# EAGLE design Multiprotocol_STM32_MB_1.1_t (EAGLE 6.6.0)

## Sheet 1 of 4
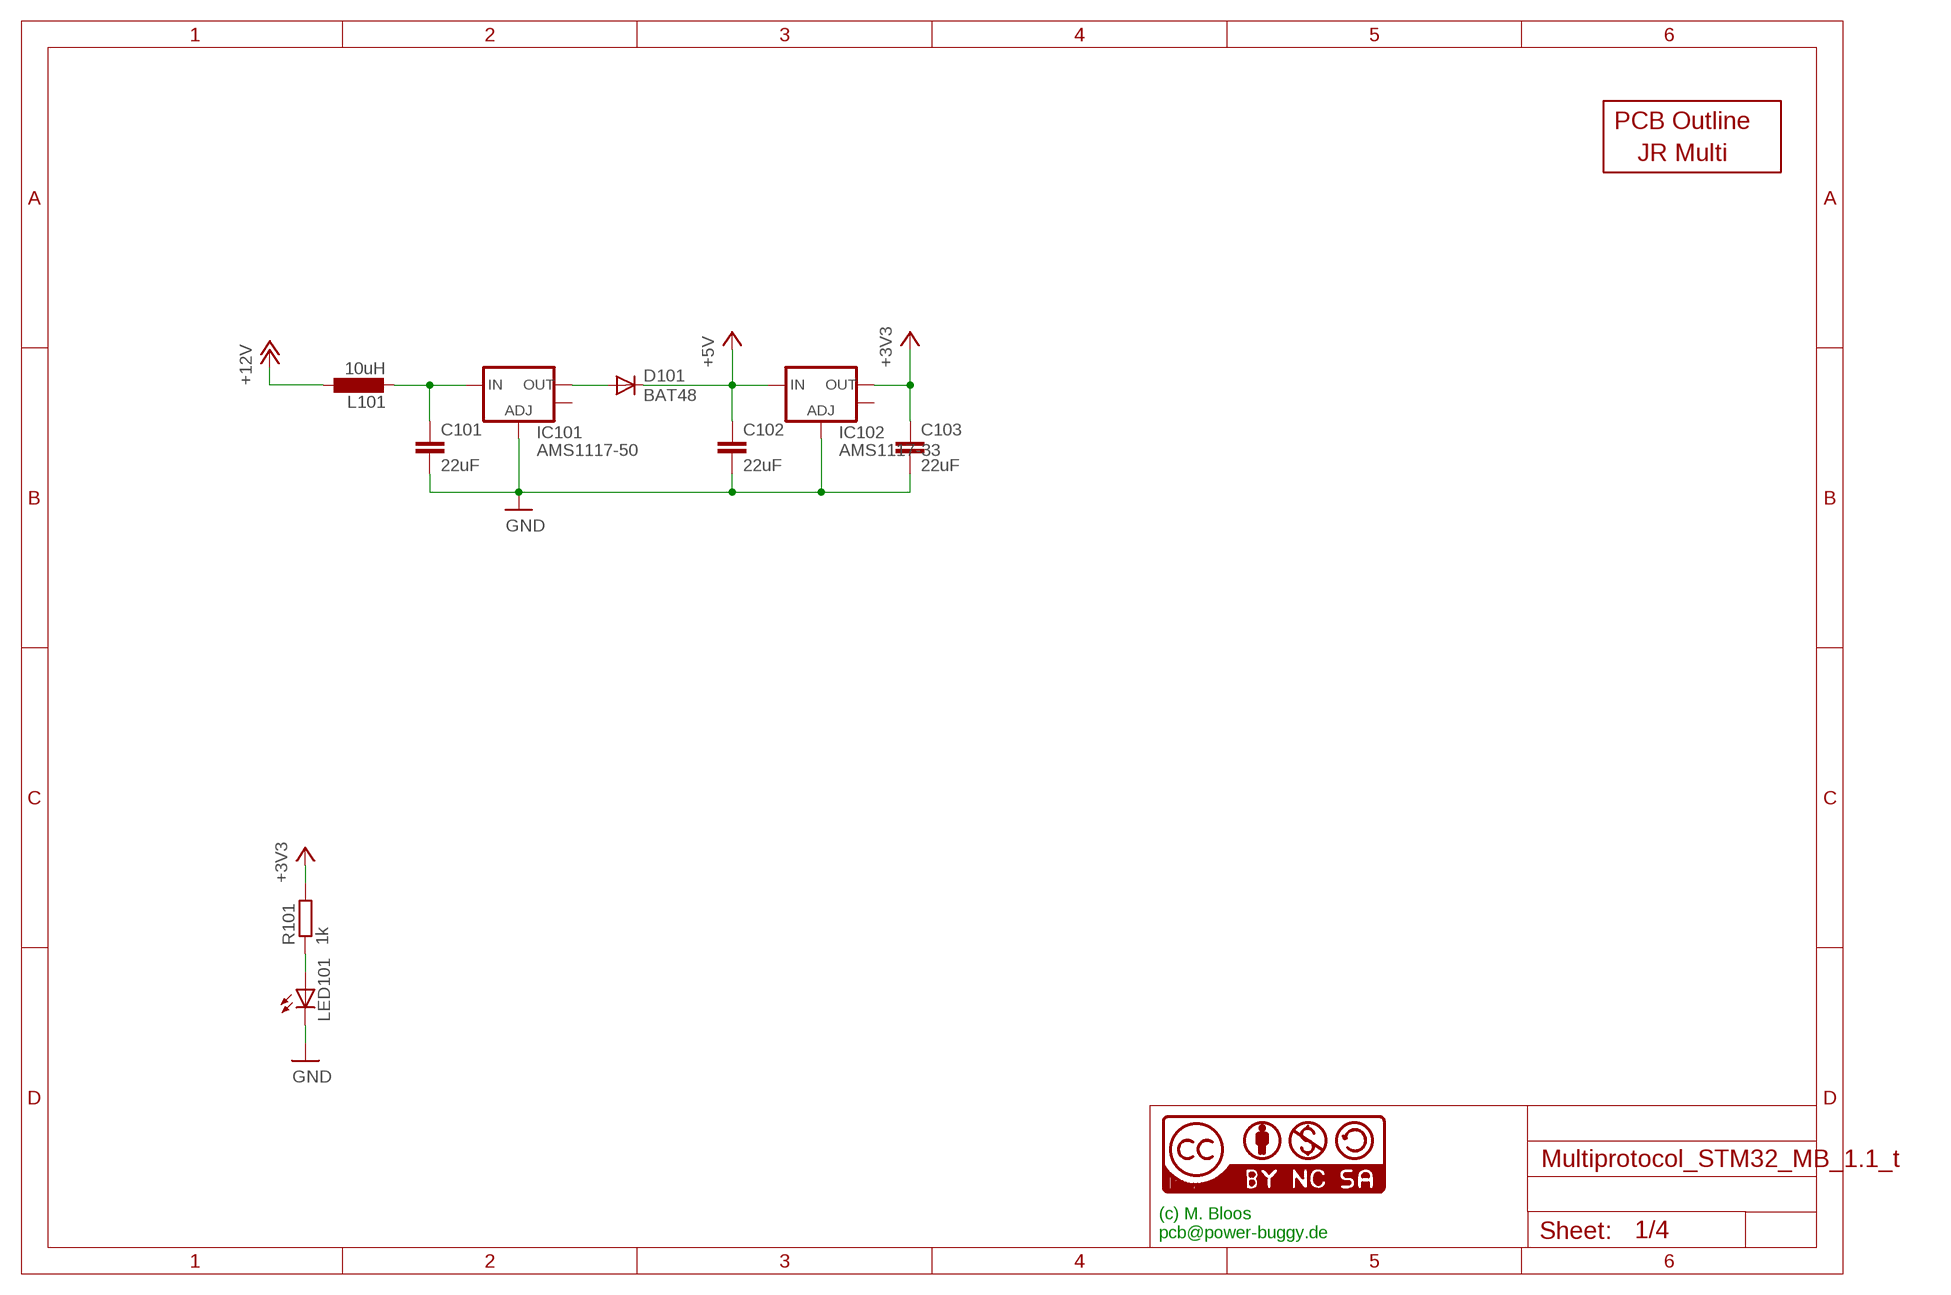
[diagram p0: schematic, sheet 1]

### Parts
C101  22uF  C-EUC1210K  [C1210K]
C102  22uF  C-EUC1210K  [C1210K]
C103  22uF  C-EUC1210K  [C1210K]
D101  BAT48  DIODE-MINIMELF  [MINIMELF]
IC101  AMS1117-50  V_REG_LM1117SOT223  [SOT223]
IC102  AMS1117-33  V_REG_LM1117SOT223  [SOT223]
L101  10uH  L-EUL1812  [L1812]
LED101  LED3MM  [LED3MM]
NIX101  CC-NC-BCNIX  [CC-NC-B_NIX]
OUTLINE101  JR_MULTI  [JR_MULTI]
R101  1k  R-EU_R0805  [R0805]

### Nets
+3V3: C103.1 IC102.2(OUT) R101.2 ; also sheet 2,3,4
+5V: C102.1 D101.C IC102.3(IN) ; also sheet 2
+12V: L101.1 ; also sheet 3
GND: C101.2 C102.2 C103.2 IC101.1(ADJ) IC102.1(ADJ) LED101.K(C) ; also sheet 2,3,4
N$4: C101.1 IC101.3(IN) L101.2
N$6: LED101.A R101.1
N$19: D101.A IC101.2(OUT)
Unconnected: IC101.4(OUT) IC102.4(OUT)

### Notes on the sheet
- (c) M. Bloos 
  pcb@power-buggy.de

## Sheet 2 of 4
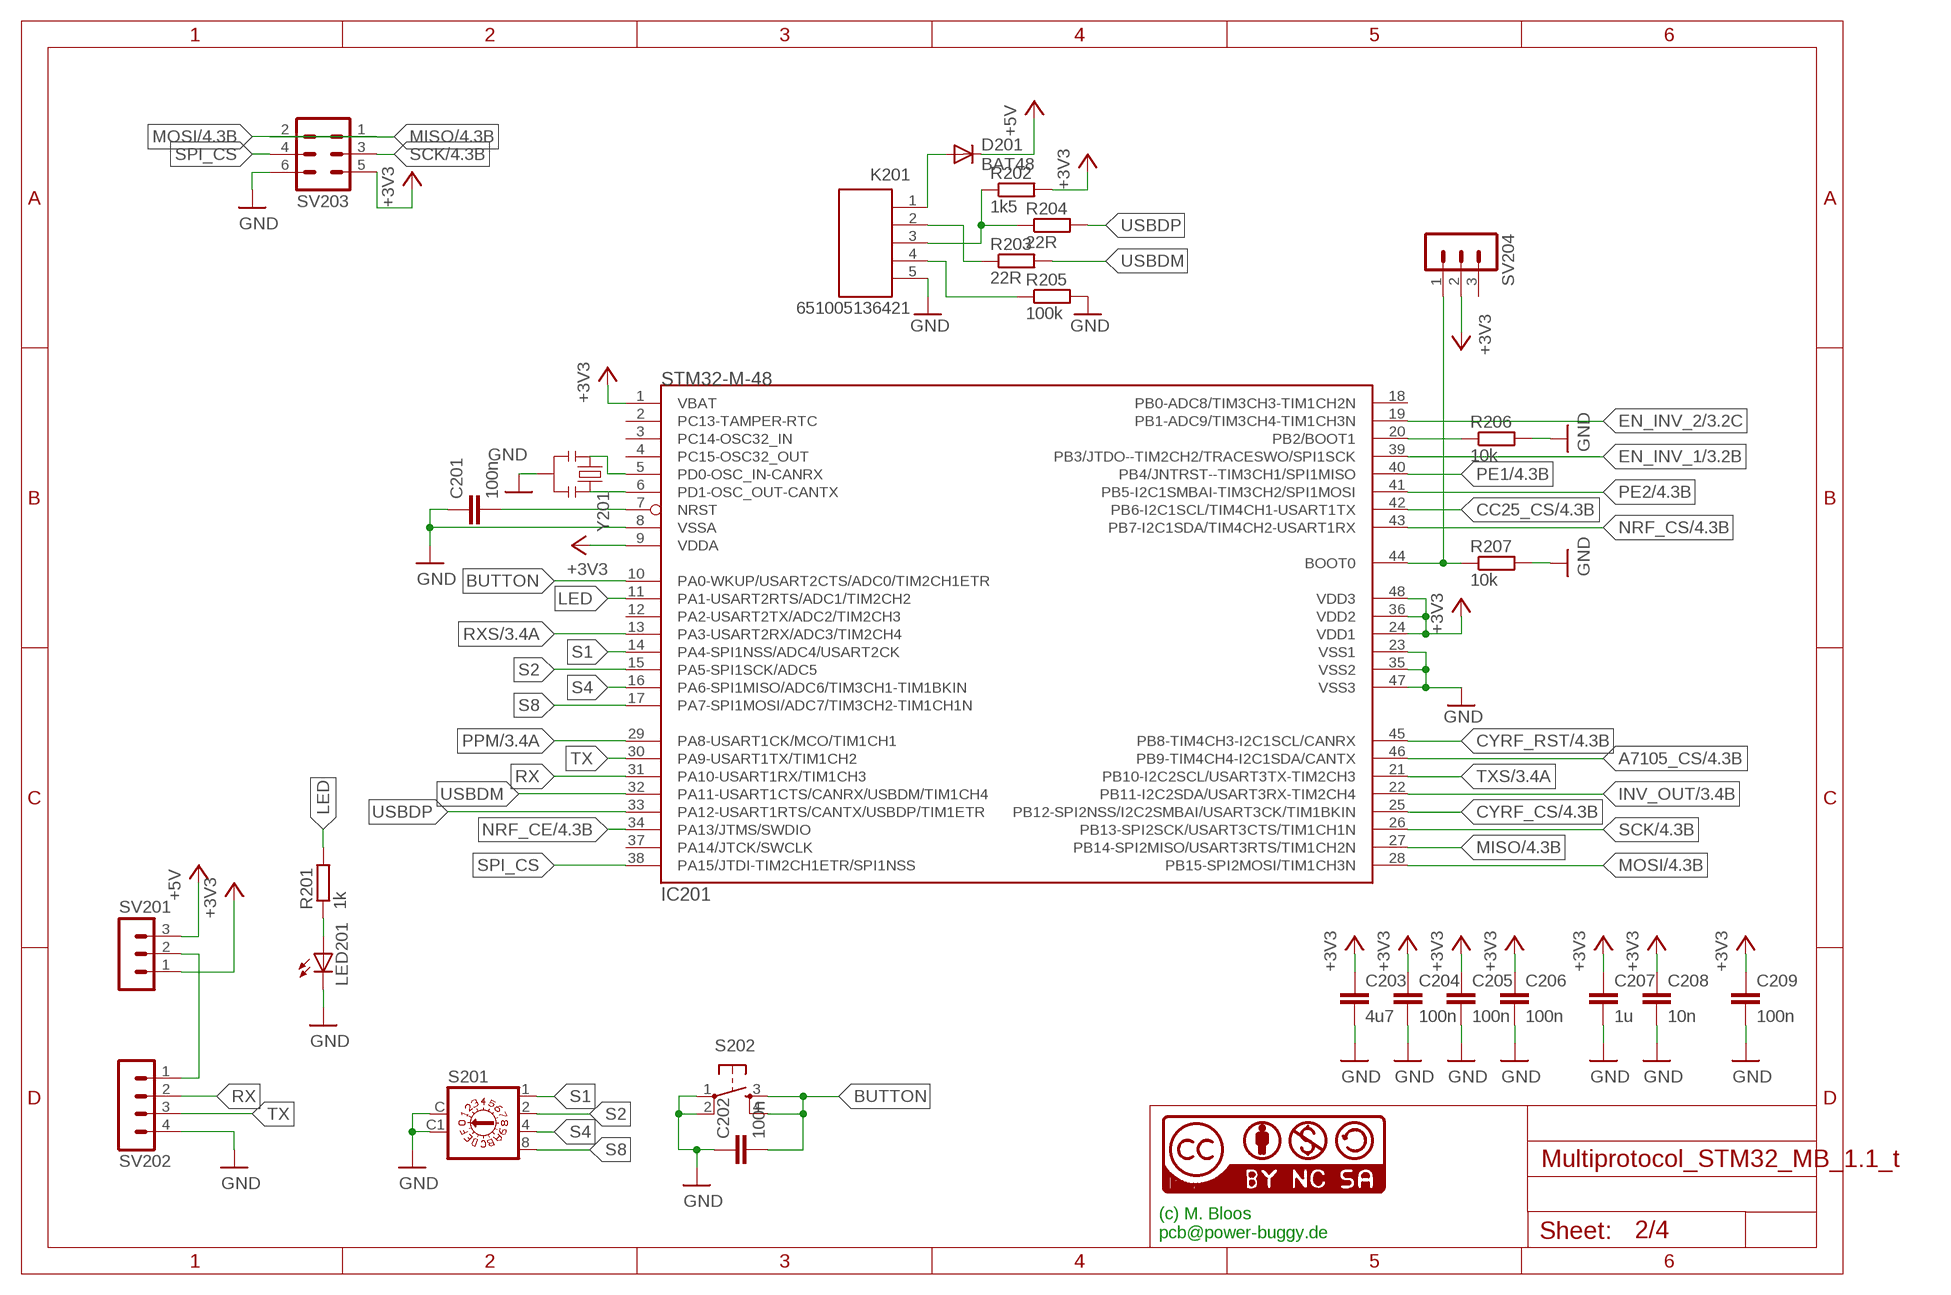
[diagram p1: schematic, sheet 2]

### Parts
C201  100n  C-EUC0805  [C0805]
C202  100n  C-EUC0805  [C0805]
C203  4u7  C-EUC0805  [C0805]
C204  100n  C-EUC0805  [C0805]
C205  100n  C-EUC0805  [C0805]
C206  100n  C-EUC0805  [C0805]
C207  1u  C-EUC0805  [C0805]
C208  10n  C-EUC0805  [C0805]
C209  100n  C-EUC0805  [C0805]
D201  BAT48  DIODE-MINIMELF  [MINIMELF]
IC201  STM32-M-48  [LQFP48]
K201  651005136421  [651005136421]
LED201  LED3MM  [LED3MM]
NIX201  CC-NC-BCNIX  [CC-NC-B_NIX]
R201  1k  R-EU_R0805  [R0805]
R202  1k5  R-EU_R0805  [R0805]
R203  22R  R-EU_R0805  [R0805]
R204  22R  R-EU_R0805  [R0805]
R205  100k  R-EU_R0805  [R0805]
R206  10k  R-EU_R0805  [R0805]
R207  10k  R-EU_R0805  [R0805]
S201  A1353HEX  [A1353HEX]
S202  TAC_SWITCHPTH  [TACTILE-PTH]
SV201  MA03-1  [MA03-1]
SV202  MA04-1  [MA04-1]
SV203  MA03-2  [MA03-2]
SV204  MA03-1  [MA03-1]
Y201  CSTCE8M00G52-R0  RESONATORSMD  [RESONATOR-SMD]

### Nets
+3V3: C203.1 C204.1 C205.1 C206.1 C207.1 C208.1 C209.1 IC201.1(VBAT) IC201.9(VDDA) IC201.24(VDD1) IC201.36(VDD2) IC201.48(VDD3) R202.2 SV201.1 SV203.5 SV204.2 ; also sheet 1,3,4
+5V: D201.C SV201.3 ; also sheet 1
A7105_CS: IC201.46(PB9-TIM4CH4-I2C1SDA/CANTX) ; also sheet 4
BUTTON: C202.2 IC201.10(PA0-WKUP/USART2CTS/ADC0/TIM2CH1ETR) S202.3 S202.4
CC25_CS: IC201.42(PB6-I2C1SCL/TIM4CH1-USART1TX) ; also sheet 4
CYRF_CS: IC201.25(PB12-SPI2NSS/I2C2SMBAI/USART3CK/TIM1BKIN) ; also sheet 4
CYRF_RST: IC201.45(PB8-TIM4CH3-I2C1SCL/CANRX) ; also sheet 4
EN_INV_1: IC201.39(PB3/JTDO--TIM2CH2/TRACESWO/SPI1SCK) ; also sheet 3
EN_INV_2: IC201.19(PB1-ADC9/TIM3CH4-TIM1CH3N) ; also sheet 3
GND: C201.1 C202.1 C203.2 C204.2 C205.2 C206.2 C207.2 C208.2 C209.2 IC201.8(VSSA) IC201.23(VSS1) IC201.35(VSS2) IC201.47(VSS3) K201.5 LED201.K(C) R205.2 R206.2 R207.2 S201.C S201.C1(NC) S202.1 S202.2 SV202.4 SV203.6 Y201.2 ; also sheet 1,3,4
INV_OUT: IC201.22(PB11-I2C2SDA/USART3RX-TIM2CH4) ; also sheet 3
LED: IC201.11(PA1-USART2RTS/ADC1/TIM2CH2) R201.2
MISO: IC201.27(PB14-SPI2MISO/USART3RTS/TIM1CH2N) SV203.2 ; also sheet 4
MOSI: IC201.28(PB15-SPI2MOSI/TIM1CH3N) SV203.1 ; also sheet 4
N$2: IC201.5(PD0-OSC_IN-CANRX) Y201.1
N$3: IC201.6(PD1-OSC_OUT-CANTX) Y201.3
N$7: SV201.2 SV202.1
N$9: K201.4 R205.1
N$11: LED201.A R201.1
N$12: C201.2 IC201.7(NRST)
N$13: K201.3 R202.1 R204.1
N$14: D201.A K201.1
N$17: K201.2 R203.1
N$23: IC201.44(BOOT0) R207.1 SV204.1
N$26: IC201.20(PB2/BOOT1) R206.1
NRF_CE: IC201.34(PA13/JTMS/SWDIO) ; also sheet 4
NRF_CS: IC201.43(PB7-I2C1SDA/TIM4CH2-USART1RX) ; also sheet 4
PE1: IC201.40(PB4/JNTRST--TIM3CH1/SPI1MISO) ; also sheet 4
PE2: IC201.41(PB5-I2C1SMBAI-TIM3CH2/SPI1MOSI) ; also sheet 4
PPM: IC201.29(PA8-USART1CK/MCO/TIM1CH1) ; also sheet 3
RX: IC201.31(PA10-USART1RX/TIM1CH3) SV202.2
RXS: IC201.13(PA3-USART2RX/ADC3/TIM2CH4) ; also sheet 3
S1: IC201.14(PA4-SPI1NSS/ADC4/USART2CK) S201.1
S2: IC201.15(PA5-SPI1SCK/ADC5) S201.2
S4: IC201.16(PA6-SPI1MISO/ADC6/TIM3CH1-TIM1BKIN) S201.4
S8: IC201.17(PA7-SPI1MOSI/ADC7/TIM3CH2-TIM1CH1N) S201.8
SCK: IC201.26(PB13-SPI2SCK/USART3CTS/TIM1CH1N) SV203.3 ; also sheet 4
SPI_CS: IC201.38(PA15/JTDI-TIM2CH1ETR/SPI1NSS) SV203.4
TX: IC201.30(PA9-USART1TX/TIM1CH2) SV202.3
TXS: IC201.21(PB10-I2C2SCL/USART3TX-TIM2CH3) ; also sheet 3
USBDM: IC201.32(PA11-USART1CTS/CANRX/USBDM/TIM1CH4) R203.2
USBDP: IC201.33(PA12-USART1RTS/CANTX/USBDP/TIM1ETR) R204.2
Unconnected: IC201.2(PC13-TAMPER-RTC) IC201.3(PC14-OSC32_IN) IC201.4(PC15-OSC32_OUT) IC201.12(PA2-USART2TX/ADC2/TIM2CH3) IC201.18(PB0-ADC8/TIM3CH3-TIM1CH2N) IC201.37(PA14/JTCK/SWCLK) SV204.3

### Notes on the sheet
- (c) M. Bloos 
  pcb@power-buggy.de

## Sheet 3 of 4
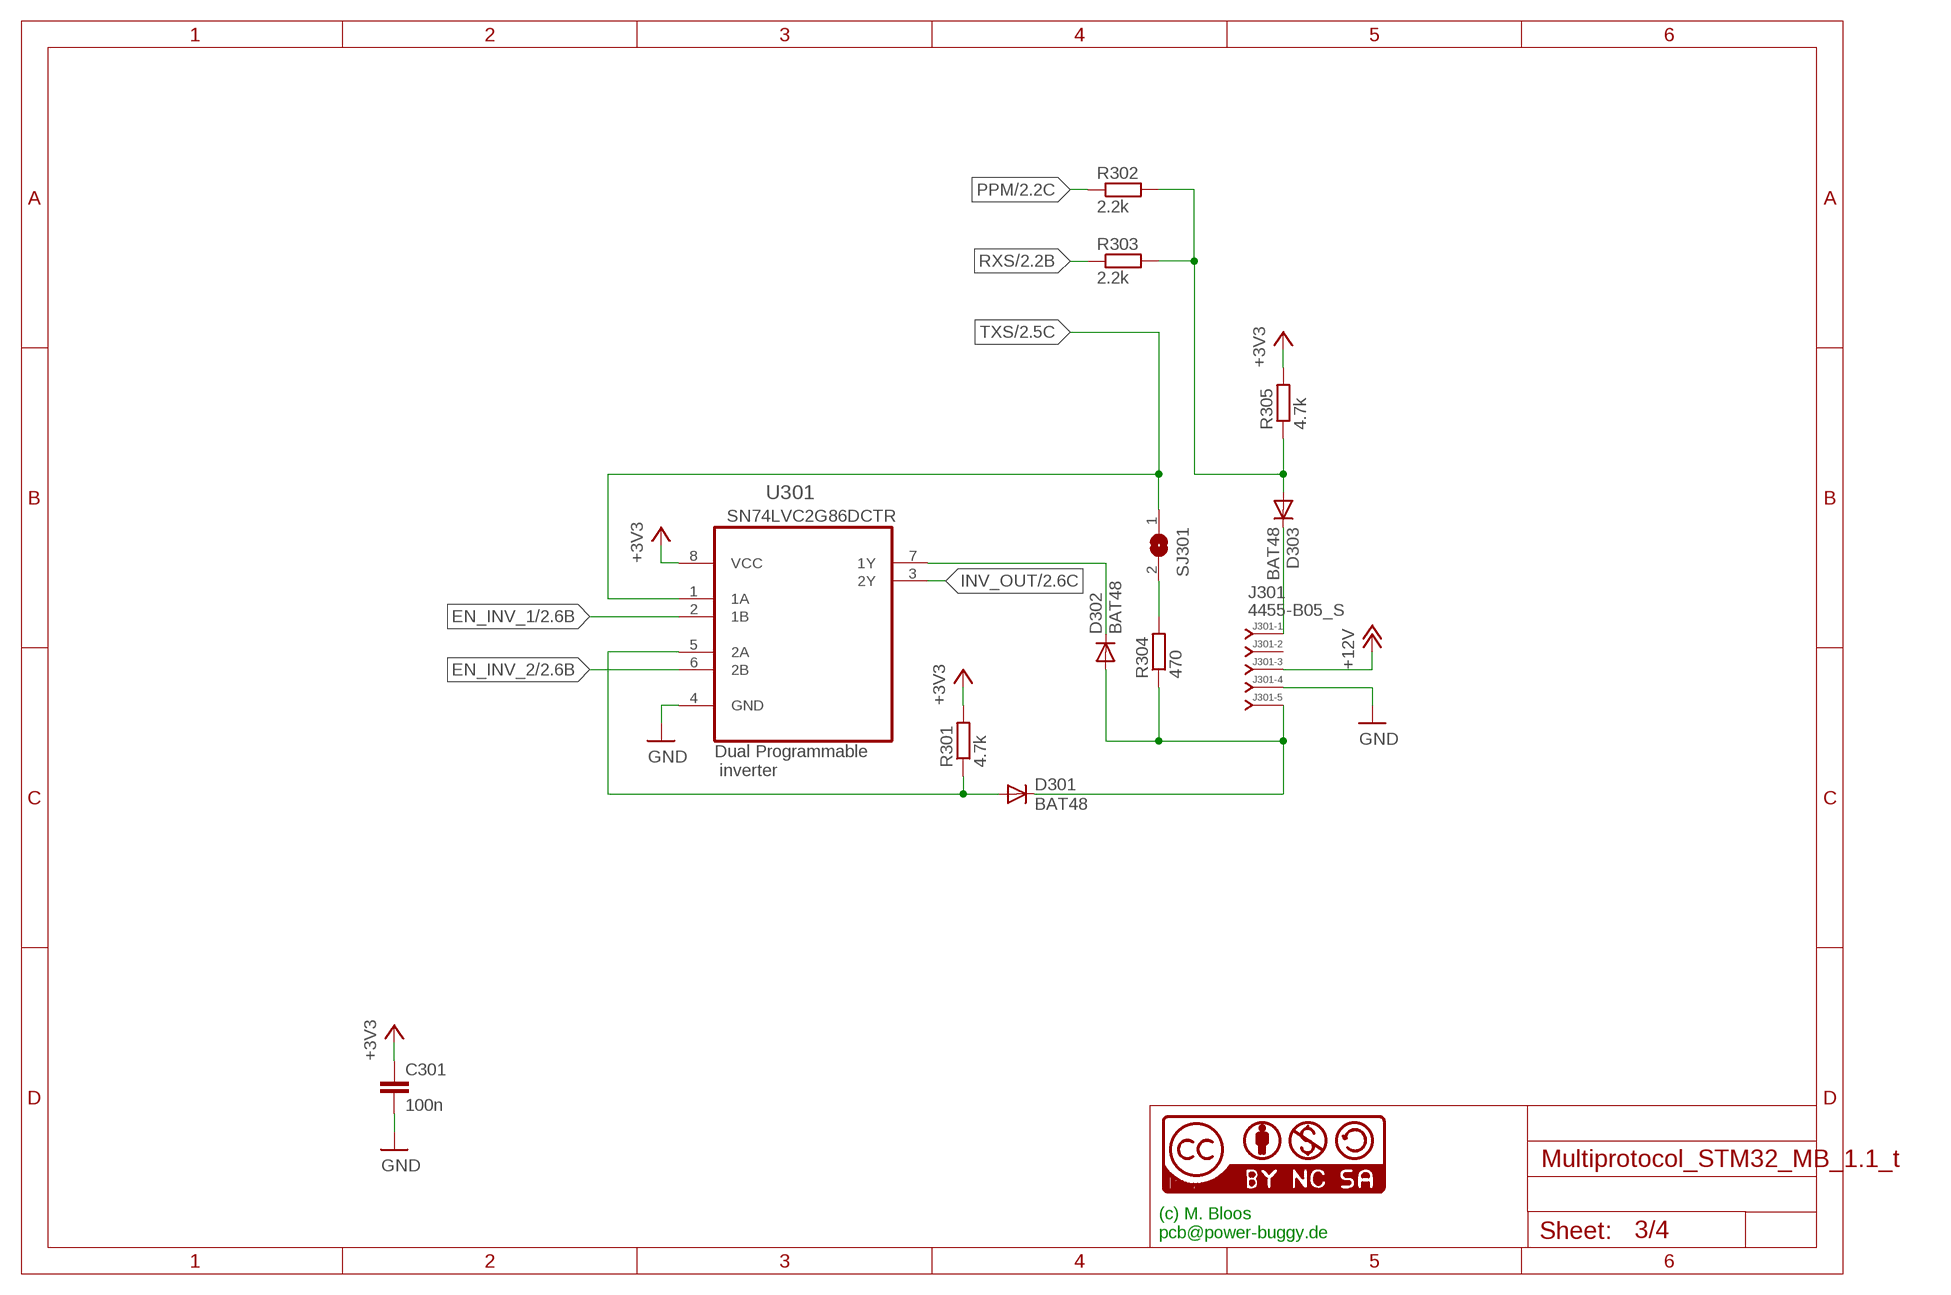
[diagram p2: schematic, sheet 3]

### Parts
C301  100n  C-EUC0805  [C0805]
D301  BAT48  DIODE-MINIMELF  [MINIMELF]
D302  BAT48  DIODE-MINIMELF  [MINIMELF]
D303  BAT48  DIODE-MINIMELF  [MINIMELF]
J301  4455-B05_S  [4455-B05]
NIX301  CC-NC-BCNIX  [CC-NC-B_NIX]
R301  4.7k  R-EU_R0805  [R0805]
R302  2.2k  R-EU_R0805  [R0805]
R303  2.2k  R-EU_R0805  [R0805]
R304  470  R-EU_R0805  [R0805]
R305  4.7k  R-EU_R0805  [R0805]
SJ301  SJ  [SJ]
U301  SN74LVC2G00DCTR  [SOP65P400X130-8N]

### Nets
+3V3: C301.1 R301.2 R305.2 U301.8(VCC) ; also sheet 1,2,4
+12V: J301.3 ; also sheet 1
EN_INV_1: U301.2(1B) ; also sheet 2
EN_INV_2: U301.6(2B) ; also sheet 2
GND: C301.2 J301.4 U301.4(GND) ; also sheet 1,2,4
INV_OUT: U301.3(2Y) ; also sheet 2
N$1: D302.C U301.7(1Y)
N$5: R304.2 SJ301.2
N$8: D301.A R301.1 U301.5(2A)
N$10: D301.C D302.A J301.5 R304.1
N$15: D303.A R302.2 R303.2 R305.1
N$18: D303.C J301.1
PPM: R302.1 ; also sheet 2
RXS: R303.1 ; also sheet 2
TXS: SJ301.1 U301.1(1A) ; also sheet 2
Unconnected: J301.2

### Notes on the sheet
- SN74LVC2G86DCTR
- Dual Programmable
   inverter
- (c) M. Bloos 
  pcb@power-buggy.de

## Sheet 4 of 4
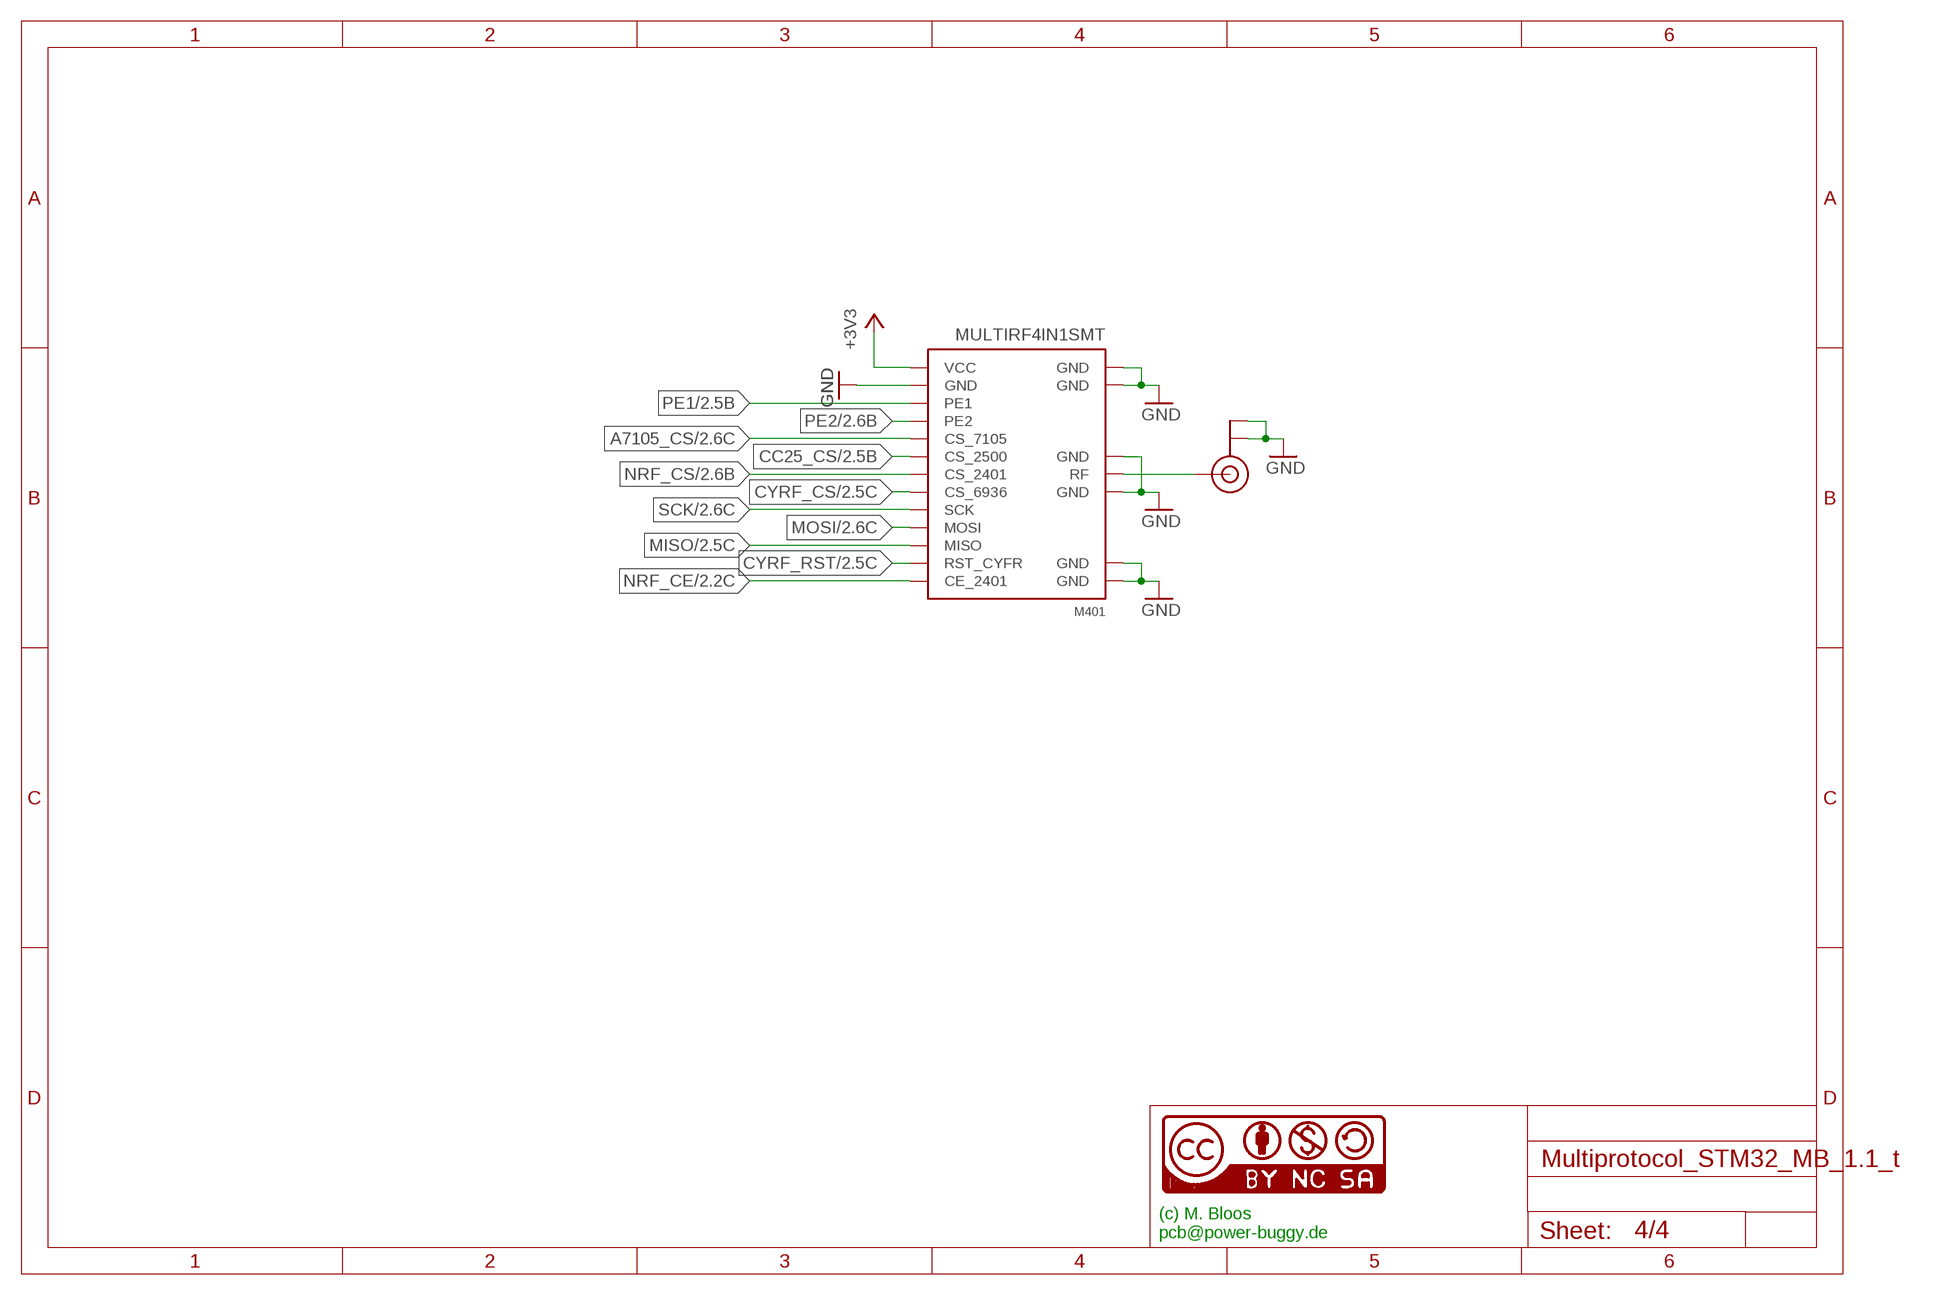
[diagram p3: schematic, sheet 4]

### Parts
CON401  U.FL  [U.FL]
M401  MULTIRF4IN1SMT  [MULTIRF4IN1-SMT]
NIX401  CC-NC-BCNIX  [CC-NC-B_NIX]

### Nets
+3V3: M401.VCC ; also sheet 1,2,3
A7105_CS: M401.CS_7105 ; also sheet 2
CC25_CS: M401.CS_2500 ; also sheet 2
CYRF_CS: M401.CS_6936 ; also sheet 2
CYRF_RST: M401.RST_CYFR ; also sheet 2
GND: CON401.P$1(GND) CON401.P$2(GND) M401.GND M401.GND@1(GND) M401.GND@2(GND) M401.GND@3(GND) M401.GND@4(GND) M401.GND@5(GND) M401.GND@6(GND) ; also sheet 1,2,3
MISO: M401.MISO ; also sheet 2
MOSI: M401.MOSI ; also sheet 2
N$16: CON401.P$3(SIGNAL) M401.RF
NRF_CE: M401.CE_2401 ; also sheet 2
NRF_CS: M401.CS_2401 ; also sheet 2
PE1: M401.PE1 ; also sheet 2
PE2: M401.PE2 ; also sheet 2
SCK: M401.SCK ; also sheet 2

### Notes on the sheet
- (c) M. Bloos 
  pcb@power-buggy.de

## Library data of the parts
C101-C103 = rcl:C-EU: CAPACITOR, European symbol
C201-C209 C301 = resistor:C-EU: CAPACITOR, European symbol
CON401 = SparkFun:U.FL
D101 D201 D301-D303 = diode:DIODE-: DIODE
IC101 IC102 = SparkFun-PowerIC:V_REG_LM1117: Voltage Regulator LM1117 Standard adjustable voltage regulator but in SMD form. Spark Fun Electronics SKU : COM-00595
IC201 = UniversalTx:STM32-M-48: STM32F103 Medium Density 48pins
J301 = con-molex-kk:4455-B05_S: RECEPTACAL
K201 = Wuerth_Elektronik_eiCan_Communication_Connectors_v2.2:651005136421: WR-COM Vertical 5 Contacts Mini USB Type B, 5 pins
L101 = resistor:L-EU: INDUCTOR, European symbol
LED101 LED201 = led:LED: LED OSRAM: - CHIPLED LG R971, LG N971, LY N971, LG Q971, LY Q971, LO R971, LY R971 LH N974, LH R974 LS Q976, LO Q976, LY Q976 LO Q996 - Hyper CHIPLED LW Q18S LB Q993, LB Q99A, LB R99A - SideLED LS A670, LO A670, LY A670, LG A670, LP A670 LB A673, LV A673, LT A673, LW A673 LH A674 LY A675 LS A676, LA A676, LO A676, LY A676, LW A676 LS A679, LY A679, LG A679 - Hyper Micro SIDELED® LS Y876, LA Y876, LO Y876, LY Y876 LT Y87S - SmartLED LW L88C, LW L88S LB L89C, LB L89S, LG L890 LS L89K, LO L89K, LY L89K LS L896, LA L896, LO L896, LY L896 - TOPLED LS T670, LO T670, LY T670, LG T670, LP T670 LSG T670, LSP T670, LSY T670, LOP T670, LYG T670 LG T671, LOG T671, LSG T671 LB T673, LV T673, LT T673, LW T673 LH T674 LS T676, LA T676, LO T676, LY T676, LB T676, LH T676, LSB T676, LW T676 LB T67C, LV T67C, LT T67C, LS T67K, LO T67K, LY T67K, LW E67C LS E67B, LA E67B, LO E67B, LY E67B, LB E67C, LV E67C, LT E67C LW T67C LS T679, LY T679, LG T679 LS T770, LO T770, LY T770, LG T770, LP T770 LB T773, LV T773, LT T773, LW T773 LH T774 LS E675, LA E675, LY E675, LS T675 LS T776, LA T776, LO T776, LY T776, LB T776 LHGB T686 LT T68C, LB T68C - Hyper Mini TOPLED® LB M676 - Mini TOPLED Santana® LG M470 LS M47K, LO M47K, LY M47K Source: http://www.osram.convergy.de LUXEON: - LUMILED® LXK2-PW12-R00, LXK2-PW12-S00, LXK2-PW14-U00, LXK2-PW14-V00 LXK2-PM12-R00, LXK2-PM12-S00, LXK2-PM14-U00 LXK2-PE12-Q00, LXK2-PE12-R00, LXK2-PE12-S00, LXK2-PE14-T00, LXK2-PE14-U00 LXK2-PB12-K00, LXK2-PB12-L00, LXK2-PB12-M00, LXK2-PB14-N00, LXK2-PB14-P00, LXK2-PB14-Q00 LXK2-PR12-L00, LXK2-PR12-M00, LXK2-PR14-Q00, LXK2-PR14-R00 LXK2-PD12-Q00, LXK2-PD12-R00, LXK2-PD12-S00 LXK2-PH12-R00, LXK2-PH12-S00 LXK2-PL12-P00, LXK2-PL12-Q00, LXK2-PL12-R00 Source: www.luxeon.com KINGBRIGHT: KA-3528ASYC Source: www.kingbright.com
M401 = 4in1_BG_V2:MULTIRF4IN1
NIX101 NIX201 NIX301 NIX401 = cc-by-nc-sa:CC-NC-BC: All hardware is licensed under the Creative Commons Attribution-Noncommercial-Share Alike 2.5 Switzerland License. To view a copy of this license, visit http://creativecommons.org/licenses/by-nc-sa/2.5/ch/ or send a letter to Creative Commons, 171 Second Street, Suite 300, San Francisco, California, 94105, USA.
OUTLINE101 = 00_meine:JR_MULTI
R101 R201-R207 R301-R305 = resistor:R-EU_: RESISTOR, European symbol
S201 = 00_meine:A1353HEX: DIL/CODE SWITCH; OC_FARNELL: unknown; OC_NEWARK: unknown
S202 = SparkFun-Electromechanical:TAC_SWITCH: Momentary Switch Button commonly used for reset or general input. Spark Fun Electronics SKU : COM-00097 SMT- SWCH-08247
SJ301 = jumper:SJ: SMD solder JUMPER
SV201 SV204 = con-lstb:MA03-1: PIN HEADER; OC_FARNELL: unknown; OC_NEWARK: unknown
SV202 = con-lstb:MA04-1: PIN HEADER; OC_FARNELL: unknown; OC_NEWARK: unknown
SV203 = con-lstb:MA03-2: PIN HEADER; OC_FARNELL: unknown; OC_NEWARK: unknown
U301 = Texas Instruments_By_element14_Batch_1:SN74LVC2G00DCTR: DUAL 2-INPUT POSITIVE-NAND GATE; MPN: SN74LVC2G00DCTR; OC_FARNELL: 1595405; OC_NEWARK: 76C4187; PACKAGE: SSOP-8; SUPPLIER: Texas Instruments
Y201 = SparkFun-FreqCtrl:RESONATOR: Resonator Small SMD resonator. This is the itty bitty 10/20MHz resonators with built in caps. CSTCE10M0G55 and CSTCE20M0V53. Footprint has been reviewed closely but hasn't been tested yet.

## Net classes
0 default: width 0.152 mm, drill 0.33 mm

## Board
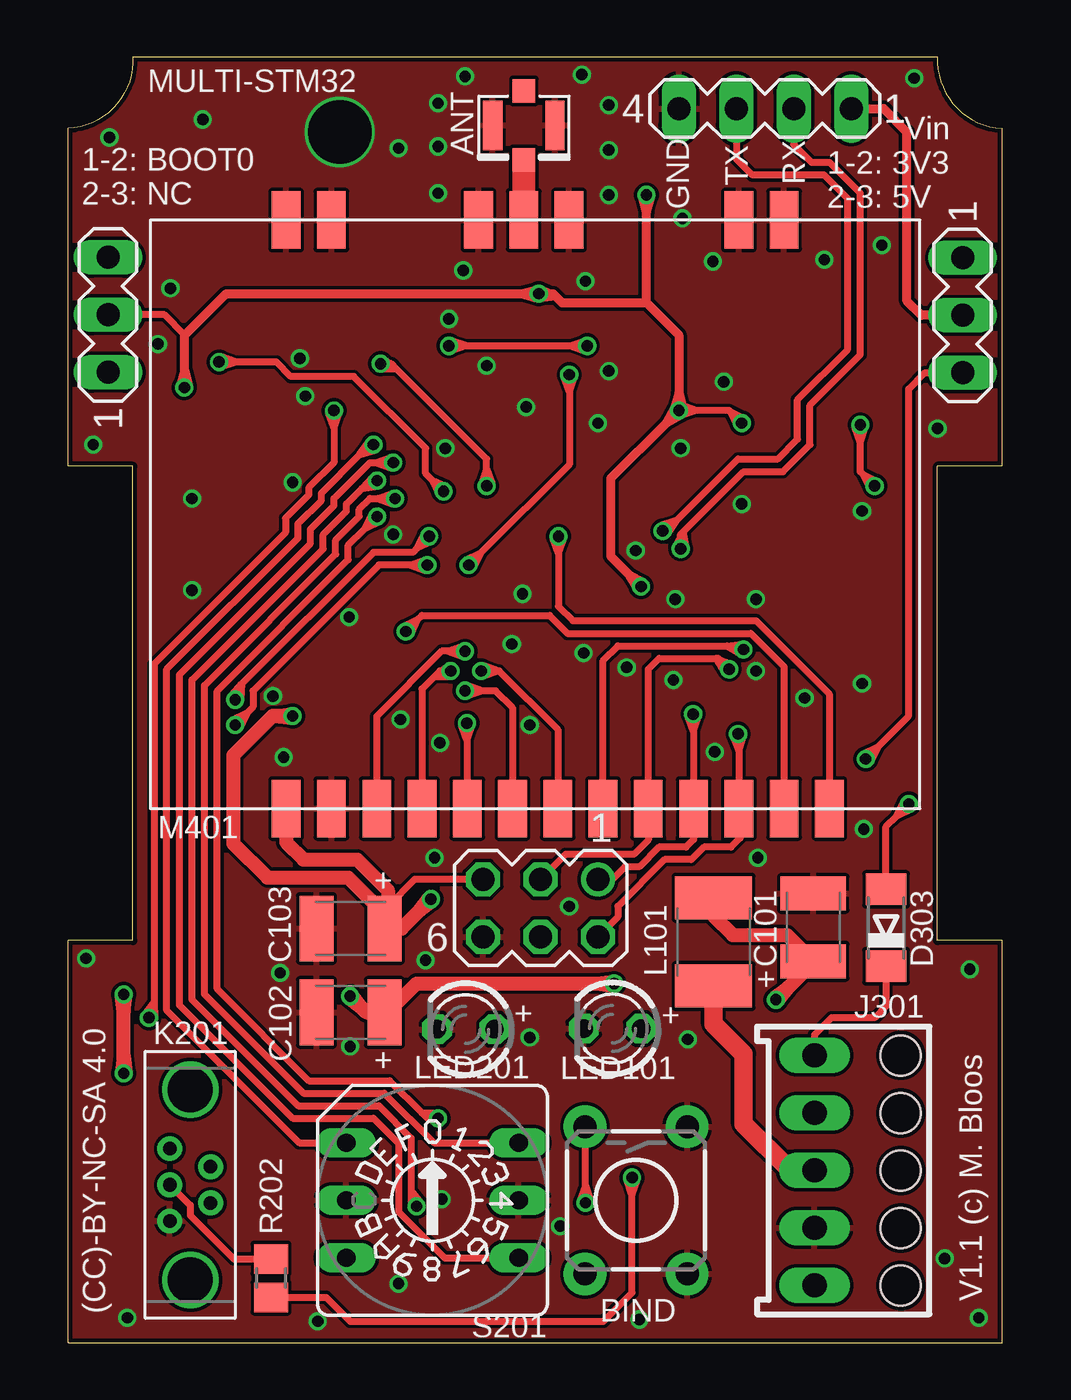
[diagram p4: board, top side]
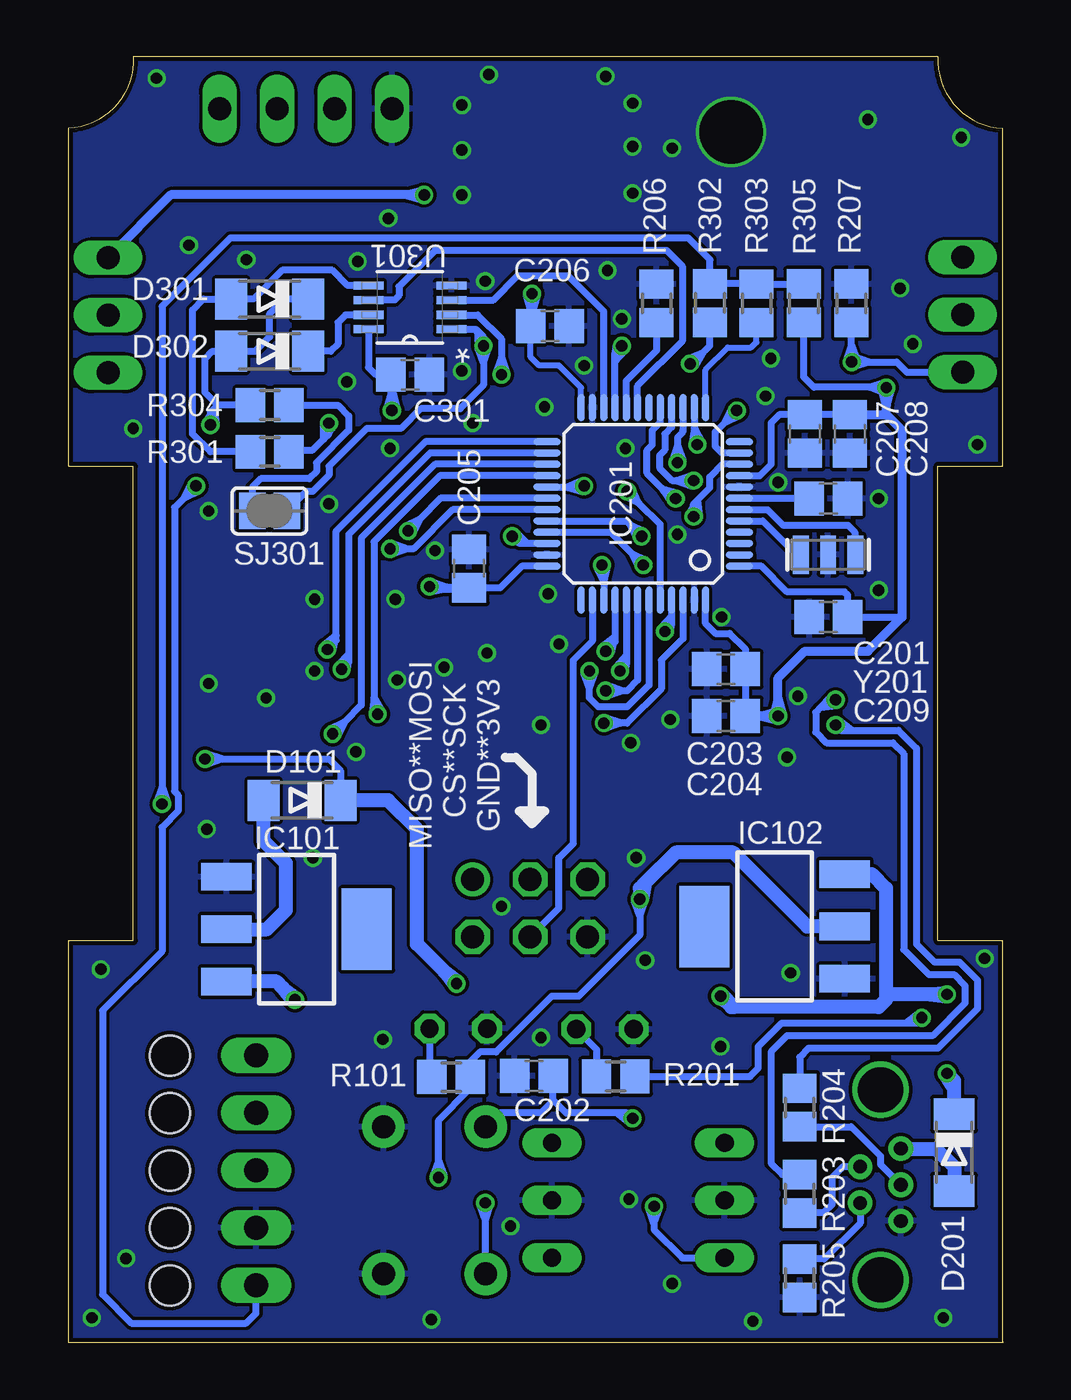
[diagram p5: board, bottom side, seen from below]

Size 41.27 x 56.83 mm. Coordinates in mm from the lower left corner, seen from the top.
Outline: 0,0.04 0,0
Outline: 40.81,0 40.81,0
Copper layers (1*16): Top 0.035mm / dielectric 1.5mm / Bottom 0.035mm
Design rules "OHM-HS_Bloos *": minimum track width 0.15mm, minimum drill 0.3mm, track to track 0.15mm, track to pad 0.15mm, pad to pad 0.15mm, via to via 0.15mm, smd to smd 0mil, copper to edge 0.2mm, drill to drill 0.2mm, minimum pad ring 0.25mm, minimum via ring 0.15mm, stop-mask expansion 0.1mm, vias tented up to drill 0.5mm, thermal gap 0.15mm

### Footprints (pad centres in the part's own frame; a part is rotated, then mirrored left to right if it is on the bottom)
C1210K = smd 1.5 x 2.9: 1 -1.5,0; 2 1.5,0
C0805 = smd 1.3 x 1.5: 1 -0.85,0; 2 0.85,0
U.FL = smd 2.2 x 0.85: P$1 0,1.375; P$2 0,-1.375 | smd 1.05 x 1: P$3 1.525,0; P$4 -1.525,0
MINIMELF = smd 1.4 x 1.8: A 1.7,0; C -1.7,0
SOT223 = smd 1.219 x 2.235: 1 -2.311,-3.099; 2 0,-3.099; 3 2.311,-3.099 | smd 3.6 x 2.2: 4 0,3.099
LQFP48 = smd 0.3 x 1.2: 1 -2.75,-4.25; 2 -2.25,-4.25; 3 -1.75,-4.25; 4 -1.25,-4.25; 5 -0.75,-4.25; 6 -0.25,-4.25; 7 0.25,-4.25; 8 0.75,-4.25; 9 1.25,-4.25; 10 1.75,-4.25; 11 2.25,-4.25; 12 2.75,-4.25; 25 2.75,4.25; 26 2.25,4.25; 27 1.75,4.25; 28 1.25,4.25; 29 0.75,4.25; 30 0.25,4.25; 31 -0.25,4.25; 32 -0.75,4.25; 33 -1.25,4.25; 34 -1.75,4.25; 35 -2.25,4.25; 36 -2.75,4.25 | smd 1.2 x 0.3: 13 4.25,-2.75; 14 4.25,-2.25; 15 4.25,-1.75; 16 4.25,-1.25; 17 4.25,-0.75; 18 4.25,-0.25; 19 4.25,0.25; 20 4.25,0.75; 21 4.25,1.25; 22 4.25,1.75; 23 4.25,2.25; 24 4.25,2.75; 37 -4.25,2.75; 38 -4.25,2.25; 39 -4.25,1.75; 40 -4.25,1.25; 41 -4.25,0.75; 42 -4.25,0.25; 43 -4.25,-0.25; 44 -4.25,-0.75; 45 -4.25,-1.25; 46 -4.25,-1.75; 47 -4.25,-2.25; 48 -4.25,-2.75
4455-B05 = drill 1.067 long: 1 -5.08,0; 2 -2.54,0; 3 0,0; 4 2.54,0; 5 5.08,0 | hole 1.778: -5.08,3.81; -2.54,3.81; 0,3.81; 2.54,3.81; 5.08,3.81
651005136421 = drill 0.6: 1 0.9,-1.6; 2 -0.9,-0.8; 3 0.9,0; 4 -0.9,0.8; 5 0.9,1.6 | drill 2: Z1 0,4.2; Z2 0,-4.2
L1812 = smd 1.9 x 3.4: 1 -1.95,0; 2 1.95,0
LED3MM = drill 0.813 octagon: A -1.27,0; K 1.27,0
MULTIRF4IN1-SMT = smd 2.54 x 1.27: CE_2401 13,13; CS_2401 13,1; CS_2500 13,-1; CS_6936 13,3; CS_7105 13,-3; GND 13,-9; GND@1 -13,11; GND@2 -13,9; GND@3 -13,1.5; GND@4 -13,-2.5; GND@5 -13,-9; GND@6 -13,-11; MISO 13,9; MOSI 13,7; PE1 13,-7; PE2 13,-5; RF -13,-0.5; RST_CYFR 13,11; SCK 13,5; VCC 13,-11
R0805 = smd 1.3 x 1.5: 1 -0.85,0; 2 0.85,0
A1353HEX = drill 0.813 long: 1 3.81,-2.54; 2 -3.81,2.54; 4 3.81,2.54; 8 -3.81,-2.54; C 3.81,0; C1 -3.81,0
TACTILE-PTH = drill 1.016 pad 1.88: 1 -3.251,2.261; 2 3.251,2.261; 3 -3.251,-2.261; 4 3.251,-2.261
SJ = smd 1.168 x 1.6: 1 -0.762,0; 2 0.762,0
MA03-1 = drill 1.016 long: 1 -2.54,0; 2 0,0; 3 2.54,0
MA04-1 = drill 1.016 long: 1 -3.81,0; 2 -1.27,0; 3 1.27,0; 4 3.81,0
MA03-2 = drill 1.016: 1 -2.54,-1.27 | drill 1.016 octagon: 2 -2.54,1.27; 3 0,-1.27; 4 0,1.27; 5 2.54,-1.27; 6 2.54,1.27
SOP65P400X130-8N = smd 1.321 x 0.356: 1 -1.829,0.965; 2 -1.829,0.33; 3 -1.829,-0.33; 4 -1.829,-0.965; 5 1.829,-0.965; 6 1.829,-0.33; 7 1.829,0.33; 8 1.829,0.965
RESONATOR-SMD = smd 0.7 x 1.7: 1 -1.2,0; 2 0,0; 3 1.2,0

### Placement (x,y rotation side)
C101  32.93,18.36 90 top
C102  12.48,14.6 180 top
C103  12.48,18.31 180 top
C201  7.7,37.31 180 bottom
C202  20.71,11.79 0 bottom
C203  12.22,29.77 180 bottom
C204  12.22,27.7 180 bottom
C205  23.57,34.21 90 bottom
C206  20,44.93 0 bottom
C207  8.73,40.16 270 bottom
C208  6.75,40.16 270 bottom
C209  7.7,32.07 180 bottom
C301  26.18,42.77 0 bottom
CON401  20.14,53.79 270 top
D101  30.96,23.97 180 bottom
D201  2.14,8.41 270 bottom
D301  32.38,46.12 180 bottom
D302  32.38,43.81 180 bottom
D303  36.14,18.34 90 top
IC101  31.2,18.28 270 bottom
IC102  10.08,18.4 90 bottom
IC201  15.88,37.07 90 bottom
J301  32.99,7.62 270 top
K201  5.4,6.99 180 top
L101  28.52,17.72 90 top
LED101  24.05,13.89 180 top
LED201  17.57,13.86 180 top
M401  20.64,36.61 270 top
NIX101  0.64,0.64 0 top
NIX201  0.71,0.64 0 top
NIX301  0.64,0.71 0 top
NIX401  0.71,0.71 0 top
OUTLINE101  0,0 0 top
R101  24.37,11.75 0 bottom
R201  17.1,11.77 0 bottom
R202  8.97,2.86 270 top
R203  8.97,6.59 90 bottom
R204  8.97,10.4 90 bottom
R205  8.97,2.86 270 bottom
R206  15.29,45.93 90 bottom
R207  6.69,45.93 90 bottom
R301  32.38,39.37 0 bottom
R302  12.93,45.94 90 bottom
R303  10.87,45.93 90 bottom
R304  32.38,41.43 0 bottom
R305  8.78,45.93 270 bottom
S201  16.1,6.3 180 top
S202  25.1,6.3 270 top
SJ301  32.4,36.76 180 bottom
SV201  39.53,45.4 270 top
SV202  30.8,54.53 180 top
SV203  20.88,19.21 180 top
SV204  1.77,45.43 90 top
U301  26.19,45.75 180 bottom
Y201  7.71,34.83 0 bottom

### Tracks (layer width: path | path; a pad name or v marks a point on that pad's centre or on a via)
+3V3  (via drill 0.5)
  Top 0.305: 5.16,44.53 4.26,45.43 SV204.2 | v29.77,40.64 29.23,41.17 | 29.23,41.17 29.21,41.2 27.74,41.2 | 27.74,41.2 v26.99,41.2 | R202.2 11.41,2.01 12.46,0.95 23.65,0.95 24.92,2.22 24.92,6.55 | 24.92,6.55 v24.92,7.3 | SV203.5 15.32,20.48 14.13,19.29 | 27.74,41.2 27.07,41.43 v26.99,41.2 | 27.74,41.2 27.07,40.96 v26.99,41.2 | 29.23,41.17 29.54,40.53 v29.77,40.64 | 29.23,41.17 29.87,40.86 v29.77,40.64 | 24.92,6.55 25.16,7.22 v24.92,7.3 | 24.92,6.55 24.69,7.22 v24.92,7.3
  Top 0.406: 5.16,42.95 5.16,42.23 v5.14,42.2 | 5.16,42.95 5.16,44.53 6.99,46.35 20.05,46.35 | 20.05,46.35 v20.8,46.35 | v20.8,46.35 21.43,46.35 21.54,46.25 | 21.54,46.25 21.83,45.96 25.56,45.96 | 25.56,45.96 26.99,44.53 26.99,41.95 | 26.99,41.95 v26.99,41.2 | v26.99,41.2 26.46,40.66 | 26.46,40.66 23.97,38.18 23.97,34.77 24.79,33.95 | 24.79,33.95 v25.32,33.42 | 25.56,45.96 25.56,49.97 | 25.56,49.97 v25.56,50.72 | 5.16,42.95 4.95,42.26 v5.14,42.2 | 5.16,42.95 5.33,42.25 v5.14,42.2 | 20.05,46.35 20.75,46.16 v20.8,46.35 | 20.05,46.35 20.75,46.55 v20.8,46.35 | 21.54,46.25 20.88,46.54 v20.8,46.35 | 21.54,46.25 20.82,46.16 v20.8,46.35 | 26.99,41.95 26.8,41.25 v26.99,41.2 | 26.99,41.95 27.18,41.25 v26.99,41.2 | 26.46,40.66 27.09,41.02 v26.99,41.2 | 26.46,40.66 26.82,41.29 v26.99,41.2 | 24.79,33.95 25.15,33.32 v25.32,33.42 | 24.79,33.95 25.42,33.59 v25.32,33.42 | 25.56,49.97 25.75,50.67 v25.56,50.72 | 25.56,49.97 25.37,50.67 v25.56,50.72
  Top 0.61: v9.92,27.7 9.17,27.7 | 9.17,27.7 9.05,27.7 7.3,25.96 7.3,22.07 8.81,20.56 12.38,20.56 13.98,18.96 C103.1 | v16.03,19.61 15.5,19.07 | 15.5,19.07 14.74,18.31 C103.1 | M401.VCC 9.64,22.11 10.4,21.35 12.78,21.35 14.13,20 14.13,19.29 14.13,18.46 C103.1 | 15.5,19.07 16.09,19.53 v16.03,19.61 | 15.5,19.07 15.96,19.66 v16.03,19.61 | 9.17,27.7 9.91,27.61 v9.92,27.7 | 9.17,27.7 9.91,27.8 v9.92,27.7
  Bottom 0.254: IC201.24 18.62,42.2 19.61,43.18 20.48,43.18 20.85,43.55 C206.1
  Bottom 0.305: C208.1 C207.1 9.87,41.01 10.24,40.64 10.24,38.81 10.74,38.32 IC201.9 | C204.1 C203.1 11.37,30.66 12.06,31.35 12.7,31.35 13.12,31.78 IC201.48 | IC201.1 10.66,34.32 9.53,33.18 6.99,33.18 6.85,33.04 C209.1 4.45,32.07 | IC201.36 21.24,34.32 22.2,33.36 C205.1 | U301.8 28.02,43.1 27.7,42.78 27.04,42.78 C301.1 | v5.14,42.2 5.16,42.23 5.89,42.23 | 5.89,42.23 8.33,42.23 8.79,42.68 R305.2 | R301.2 31.46,39.45 30.48,39.45 30,39.93 | 30,39.93 29.77,40.16 v29.77,40.64 | v24.92,7.3 24.92,8.05 | 24.92,8.05 24.92,9.84 23.57,11.19 23.57,11.69 R101.2 23.52,12.44 23.1,12.86 22.38,12.86 19.92,15.32 18.73,15.32 16.03,18.02 16.03,18.86 | v16.03,19.61 16.03,18.86 | 5.89,42.23 5.21,42.44 v5.14,42.2 | 5.89,42.23 5.22,41.97 v5.14,42.2 | 16.03,18.86 16.27,19.52 v16.03,19.61 | 16.03,18.86 15.8,19.52 v16.03,19.61 | 30,39.93 30.01,40.64 v29.77,40.64 | 30,39.93 29.57,40.49 v29.77,40.64 | 24.92,8.05 24.69,7.38 v24.92,7.3 | 24.92,8.05 25.16,7.38 v24.92,7.3
  Bottom 0.406: C208.1 5.14,41.01 | 5.14,41.01 4.45,40.32 4.45,32.07 5.95,30.56 8.73,30.56 9.92,29.37 9.92,28.45 | 5.14,41.01 5.14,41.45 | 5.14,41.45 v5.14,42.2 | v20.8,46.35 20.8,45.6 | 20.8,45.6 20.8,44.98 C206.1 | v26.99,41.2 26.99,41.95 | 26.99,41.95 26.99,42.73 C301.1 | v25.32,33.42 25.26,33.36 24.57,33.36 | 24.57,33.36 C205.1 | v25.56,50.72 26.31,50.72 | 26.31,50.72 36.75,50.72 SV201.1 | v9.92,27.7 9.92,28.45 | C204.1 10.67,27.7 | 10.67,27.7 v9.92,27.7 | 5.14,41.45 5.33,42.15 v5.14,42.2 | 5.14,41.45 4.95,42.15 v5.14,42.2 | 20.8,45.6 20.99,46.3 v20.8,46.35 | 20.8,45.6 20.61,46.3 v20.8,46.35 | 26.99,41.95 26.8,41.25 v26.99,41.2 | 26.99,41.95 27.18,41.25 v26.99,41.2 | 24.57,33.36 25.28,33.22 v25.32,33.42 | 24.57,33.36 25.25,33.6 v25.32,33.42 | 26.31,50.72 25.61,50.91 v25.56,50.72 | 26.31,50.72 25.61,50.53 v25.56,50.72 | 9.92,28.45 9.73,27.75 v9.92,27.7 | 9.92,28.45 10.11,27.75 v9.92,27.7 | 10.67,27.7 9.97,27.89 v9.92,27.7 | 10.67,27.7 9.97,27.51 v9.92,27.7
  Bottom 0.61: IC102.2 8.64,18.4 11.91,21.67 14.45,21.67 15.8,20.32 | 15.8,20.32 16.03,20.08 v16.03,19.61 | 15.8,20.32 15.94,19.59 v16.03,19.61 | 15.8,20.32 16.12,19.65 v16.03,19.61
+5V  (via drill 0.5)
  Top 0.305: v35.24,25.8 35.77,26.33 | 35.77,26.33 37.15,27.7 37.15,42.15 37.86,42.86 SV201.3 | 35.77,26.33 35.13,26.02 v35.24,25.8 | 35.77,26.33 35.47,25.69 v35.24,25.8
  Top 0.61: 23.38,15.88 15.4,15.88 14.13,14.6 C102.1 13.18,14.6 12.99,14.79 | 23.38,15.88 v24.13,15.88 | v2.46,11.91 2.46,12.66 | 2.46,12.66 2.46,14.65 | 2.46,14.65 v2.46,15.4 | v12.46,15.32 12.99,14.79 | 23.38,15.88 24.12,15.78 v24.13,15.88 | 23.38,15.88 24.12,15.97 v24.13,15.88 | 12.99,14.79 12.54,15.38 v12.46,15.32 | 12.99,14.79 12.4,15.24 v12.46,15.32 | 2.46,12.66 2.37,11.92 v2.46,11.91 | 2.46,12.66 2.56,11.92 v2.46,11.91 | 2.46,14.65 2.56,15.39 v2.46,15.4 | 2.46,14.65 2.37,15.39 v2.46,15.4
  Bottom 0.305: v35.24,25.8 34.49,25.8 | 34.49,25.8 29.77,25.8 29.26,25.29 D101.C | 34.49,25.8 35.16,25.56 v35.24,25.8 | 34.49,25.8 35.16,26.03 v35.24,25.8
  Bottom 0.61: IC102.3 5.79,20.71 5.16,20.08 5.16,15.56 | 5.16,15.56 5.16,15.16 5.48,14.84 11.88,14.84 | 11.88,14.84 11.99,14.84 v12.46,15.32 | D201.C 2.14,11.23 | 2.14,11.23 2.14,11.59 v2.46,11.91 | v2.46,15.4 3.21,15.4 | 3.21,15.4 5,15.4 5.16,15.56 | v24.13,15.88 24.66,16.41 | 24.66,16.41 25.88,17.62 25.88,22.7 27.15,23.97 D101.C | 24.66,16.41 24.07,15.95 v24.13,15.88 | 24.66,16.41 24.2,15.82 v24.13,15.88 | 11.88,14.84 12.51,15.24 v12.46,15.32 | 11.88,14.84 12.39,15.38 v12.46,15.32 | 2.14,11.23 2.54,11.86 v2.46,11.91 | 2.14,11.23 2.37,11.94 v2.46,11.91 | 3.21,15.4 2.47,15.49 v2.46,15.4 | 3.21,15.4 2.47,15.3 v2.46,15.4
+12V
  Top 0.813: J301.3 31.91,7.62 29.84,9.68 29.84,12.78 28.52,14.11 L101.1
A7105_CS  (via drill 0.5)
  Top 0.305: 17.64,26.64 17.64,27.37 v17.62,27.38 | 17.64,26.64 M401.CS_7105 | 17.64,26.64 17.86,27.31 v17.62,27.38 | 17.64,26.64 17.39,27.3 v17.62,27.38
  Bottom 0.305: IC201.46 14.12,31.12 15.08,30.16 15.08,28.89 16.59,27.38 16.87,27.38 | 16.87,27.38 v17.62,27.38 | 16.87,27.38 17.54,27.15 v17.62,27.38 | 16.87,27.38 17.54,27.62 v17.62,27.38
BUTTON  (via drill 0.5)
  Top 0.305: 13.12,35.98 12.38,35.24 12.38,34.61 6.59,28.81 6.59,15.64 10.64,11.59 14.21,11.59 15.64,10.16 | 13.12,35.98 v13.65,36.51 | 15.64,10.16 15.88,9.92 v16.35,9.92 | v22.86,6.19 22.86,6.94 | 22.86,6.94 22.86,9.53 S202.3 | 13.12,35.98 13.76,36.29 v13.65,36.51 | 13.12,35.98 13.43,36.62 v13.65,36.51 | 15.64,10.16 16.2,9.73 v16.35,9.92 | 15.64,10.16 16.35,10.17 v16.35,9.92 | 22.86,6.94 22.63,6.27 v22.86,6.19 | 22.86,6.94 23.09,6.27 v22.86,6.19
  Bottom 0.305: IC201.10 12.38,38.82 12.94,38.26 12.94,37.78 13.48,37.24 | v13.65,36.51 13.65,37.07 13.48,37.24 | v16.35,9.92 16.59,10.16 17.06,10.16 | 17.06,10.16 19.29,10.16 19.86,10.73 | 19.86,10.73 C202.2 | 19.86,10.73 19.86,10.7 20.4,10.16 22.23,10.16 S202.3 | S202.4 22.84,5.44 | 22.84,5.44 22.84,6.17 v22.86,6.19 | 13.48,37.24 13.41,36.54 v13.65,36.51 | 13.48,37.24 13.86,36.65 v13.65,36.51 | 17.06,10.16 16.36,10.17 v16.35,9.92 | 17.06,10.16 16.5,9.73 v16.35,9.92 | 22.84,5.44 23.09,6.1 v22.86,6.19 | 22.84,5.44 22.62,6.12 v22.86,6.19
CC25_CS  (via drill 0.5)
  Top 0.305: M401.CS_2500 19.64,28.07 18.89,28.81 18.29,28.81 | 18.29,28.81 v17.54,28.81 | 18.29,28.81 17.62,29.05 v17.54,28.81 | 18.29,28.81 17.62,28.58 v17.54,28.81
  Bottom 0.305: IC201.42 16.12,29.28 16.59,28.81 16.79,28.81 | 16.79,28.81 v17.54,28.81 | 16.79,28.81 17.46,28.58 v17.54,28.81 | 16.79,28.81 17.46,29.05 v17.54,28.81
CYRF_CS  (via drill 0.5)
  Top 0.305: 29.11,30.8 24.29,30.8 23.64,30.15 M401.CS_6936 | 29.11,30.8 29.69,30.8 v29.84,30.64 | 29.11,30.8 29.72,30.43 v29.84,30.64 | 29.11,30.8 29.82,30.88 v29.84,30.64
  Bottom 0.305: IC201.25 25.51,39.82 29.45,35.88 29.45,31.27 | v29.84,30.64 29.45,31.04 29.45,31.27 | 29.45,31.27 29.6,30.58 v29.84,30.64 | 29.45,31.27 30,30.83 v29.84,30.64
CYRF_RST  (via drill 0.5)
  Top 0.305: v14.92,31.43 15.45,31.96 | 15.45,31.96 15.64,32.15 21.27,32.15 22.07,31.35 30.16,31.35 31.64,29.88 M401.RST_CYFR | 15.45,31.96 14.81,31.66 v14.92,31.43 | 15.45,31.96 15.15,31.32 v14.92,31.43
  Bottom 0.305: IC201.45 14.62,32.12 | 14.62,32.12 14.62,31.73 v14.92,31.43 | 14.62,32.12 14.68,31.41 v14.92,31.43 | 14.62,32.12 15.11,31.6 v14.92,31.43
EN_INV_1  (via drill 0.5)
  Top 0.305: v22.15,42.78 22.15,42.03 | 22.15,42.03 22.15,38.81 18.23,34.9 | 18.23,34.9 v17.7,34.37 | 22.15,42.03 22.38,42.7 v22.15,42.78 | 22.15,42.03 21.91,42.7 v22.15,42.78 | 18.23,34.9 17.59,34.59 v17.7,34.37 | 18.23,34.9 17.92,34.26 v17.7,34.37
  Bottom 0.305: U301.2 23.2,45.42 22.15,44.37 22.15,43.53 | 22.15,43.53 v22.15,42.78 | v17.7,34.37 17.62,34.29 17.62,33.62 | 17.62,33.62 IC201.39 | 22.15,43.53 21.91,42.87 v22.15,42.78 | 22.15,43.53 22.38,42.87 v22.15,42.78 | 17.62,33.62 17.93,34.26 v17.7,34.37 | 17.62,33.62 17.46,34.31 v17.7,34.37
EN_INV_2
  Bottom 0.305: IC201.19 16.12,42.3 14.13,44.29 14.13,47.55 14.84,48.26 25.08,48.26 26.67,46.67 26.67,46.28 26.86,46.08 U301.6
GND  (via drill 0.5, 2.8)
  Bottom 0.305: 8.73,39.13 8.97,39.13
  other vias: 10.48,41.83 5.48,37.31 14.37,35.72 9.92,38.02 5.48,33.26 1.11,39.69 18.49,43.18 22.86,46.91 23.89,42.94 17.46,47.39 20.24,41.35 28.97,42.47 3.97,44.13 4.52,46.59 25.08,35 16.67,39.53 27.15,49.69 35.96,48.5 28.5,47.78 27.07,39.53 23.42,40.64 20.08,33.1 19.61,30.88 24.69,29.84 22.78,30.48 26.75,29.29 30.4,29.69 32.54,28.5 26.83,32.86 30.4,32.86 29.77,37.07 14.68,27.54 16.43,26.51 20.4,27.3 9.37,16.35 0.79,16.99 16.51,6.35 12.46,13.1 15.8,16.91 20.4,13.49 28.57,26.11 30.48,21.43 16.19,21.43 35.16,22.7 39.85,16.51 35.08,29.13 35.08,36.75 38.42,40.4 23.89,50.72 16.35,50.8 16.35,52.86 23.89,52.7 23.89,54.69 22.7,56.04 16.35,54.77 17.54,55.96 5.95,54.05 1.83,53.26 14.61,52.78 37.39,55.88 40.24,1.11 38.73,3.73 25.24,1.03 21.75,5.16 14.61,2.62 11.03,0.95 2.62,1.11 10.24,43.5 12.42,32.07 9.05,28.57 9.53,25.88 22.15,19.29 27.38,13.41 16.83,45.24 12,53.5 33.42,47.86
  pour Top: -0.04,-0.09 41.45,-0.19 41.56,17.86 38.5,17.92 38.58,38.54 41.45,38.52 41.43,52.43 41.33,57 0.04,56.95 0.04,52.49 -0.12,38.68 2.85,38.65 3,17.88 -0.02,17.85
  pour Bottom: 0,-0.02 41.5,-0.22 41.6,17.91 38.56,17.97 38.69,38.6 41.45,38.51 41.42,52.45 41.37,56.98 0.03,56.95 0.01,52.48 -0.13,38.69 2.85,38.65 3,17.85 -0.01,17.87 0,-0.01
INV_OUT
  Bottom 0.305: IC201.22 17.62,45.56 19.21,47.15 21.43,47.15 22.5,46.08 U301.3
LED  (via drill 0.5)
  Top 0.305: v11.75,41.2 11.75,40.45 | 11.75,40.45 11.75,38.89 10.64,37.78 10.64,37.47 9.6,36.43 9.6,35.8 3.81,30 3.81,15.08 | 3.81,15.08 3.81,14.61 v3.57,14.37 | 11.75,40.45 11.98,41.11 v11.75,41.2 | 11.75,40.45 11.51,41.11 v11.75,41.2 | 3.81,15.08 3.38,14.52 v3.57,14.37 | 3.81,15.08 3.82,14.37 v3.57,14.37
  Bottom 0.305: IC201.11 12.41,39.32 12.7,39.61 12.7,40.24 12.28,40.66 | 12.28,40.66 v11.75,41.2 | R201.2 11.16,11.78 10.79,12.14 10.79,13.1 9.76,14.13 4.28,14.13 | 4.28,14.13 3.81,14.13 v3.57,14.37 | 12.28,40.66 11.97,41.3 v11.75,41.2 | 12.28,40.66 11.64,40.97 v11.75,41.2 | 4.28,14.13 3.72,14.56 v3.57,14.37 | 4.28,14.13 3.58,14.12 v3.57,14.37
MISO  (via drill 0.5)
  Top 0.305: v29.61,26.91 29.64,26.88 29.64,26.16 | 29.64,26.16 M401.MISO 29.69,23.56 29.69,22.3 29.29,21.91 28.1,21.91 27.54,21.35 26.35,21.35 24.29,19.29 24.29,18.81 SV203.2 | 29.64,26.16 29.84,26.84 v29.61,26.91 | 29.64,26.16 29.38,26.82 v29.61,26.91
  Bottom 0.305: IC201.27 25.08,38.82 28.34,35.56 28.34,28.18 29.08,27.44 | 29.08,27.44 v29.61,26.91 | 29.08,27.44 29.38,26.8 v29.61,26.91 | 29.08,27.44 29.71,27.13 v29.61,26.91
MOSI  (via drill 0.5)
  Top 0.305: v27.62,27.78 27.64,27.77 27.64,27.03 | 27.64,27.03 M401.MOSI 27.64,22.24 27.3,21.91 26.11,21.91 25.24,21.03 24.61,21.03 24.05,20.48 SV203.1 | 27.64,27.03 27.86,27.7 v27.62,27.78 | 27.64,27.03 27.39,27.7 v27.62,27.78
  Bottom 0.305: IC201.28 24.86,38.32 27.78,35.4 27.78,28.51 | 27.78,28.51 27.78,28.34 27.62,28.18 v27.62,27.78 | 27.78,28.51 27.41,27.91 v27.62,27.78 | 27.78,28.51 27.87,27.81 v27.62,27.78
N$1
  Bottom 0.305: U301.7 29.03,45.42 29.37,45.09 29.37,44.13 29.69,43.81 D302.C
N$2
  Bottom 0.305: IC201.5 10.6,36.32 9.11,34.83 Y201.1
N$3
  Bottom 0.305: IC201.6 10.39,36.82 9.68,36.12 6.83,36.12 6.51,35.8 Y201.3
N$4  (via drill 0.5)
  Top 0.61: 31.8,15.69 32.93,16.81 C101.1 31.77,18.02 29.37,18.02 28.52,18.87 L101.2 | 31.8,15.69 v31.27,15.16 | 31.8,15.69 31.22,15.24 v31.27,15.16 | 31.8,15.69 31.35,15.1 v31.27,15.16
  Bottom 0.61: v31.27,15.16 31.8,15.69 | 31.8,15.69 32.08,15.97 IC101.3 | 31.8,15.69 31.22,15.24 v31.27,15.16 | 31.8,15.69 31.35,15.1 v31.27,15.16
N$5
  Bottom 0.305: R304.2 29.37,41.43 28.89,40.96 28.89,40.32 30.32,38.89 30.32,38.5 30.64,38.18 32.78,38.18 33.16,37.8 SJ301.2
N$6
  Bottom 0.305: LED101.A 25.32,11.85 R101.1
N$7
  Top 0.406: SV201.2 37.7,45.4 37.07,46.04 37.07,53.5 36.04,54.53 SV202.1
N$8
  Bottom 0.305: U301.5 28.93,46.72 29.61,47.39 31.83,47.39 33.1,46.12 D301.A 35.32,46.12 35.8,45.64 35.8,40.16 35,39.37 R301.1
N$9
  Bottom 0.305: K201.4 6.3,5.29 7.88,3.71 R205.1
N$10  (via drill 0.5)
  Top 0.305: v35.64,37.86 35.11,38.39 | 35.11,38.39 35,38.5 35,39.81 | 35,39.81 v35,40.56 | 35.11,38.39 35.42,37.75 v35.64,37.86 | 35.11,38.39 35.75,38.09 v35.64,37.86 | 35,39.81 35.24,40.48 v35,40.56 | 35,39.81 34.77,40.48 v35,40.56
  Bottom 0.305: J301.5 32.99,1.3 33.42,0.87 38.5,0.87 39.77,2.14 39.77,14.68 37.15,17.3 37.15,22.78 36.43,23.5 36.43,24.21 36.59,24.37 36.59,36.91 36.17,37.33 | D301.C 31.75,46.12 32.38,45.48 32.38,44.45 33.02,43.81 D302.A 34.92,43.81 35.24,43.5 35.24,41.99 34.69,41.43 | R304.1 34.69,41.43 | 36.17,37.33 v35.64,37.86 | v35,40.56 35,41.12 34.83,41.29 | 34.83,41.29 34.69,41.43 | 36.17,37.33 35.86,37.97 v35.64,37.86 | 36.17,37.33 35.53,37.64 v35.64,37.86 | 34.83,41.29 34.76,40.59 v35,40.56 | 34.83,41.29 35.21,40.69 v35,40.56
N$11
  Bottom 0.305: LED201.A 17.95,12.97 R201.1
N$12
  Bottom 0.305: IC201.7 C201.2
N$13
  Top 0.305: K201.3 5.4,6.08 5.4,5.64 7.33,3.71 R202.1
  Bottom 0.305: R204.1 6.69,9.55 5.4,8.26 5.4,7.88 K201.3
N$14
  Bottom 0.61: K201.1 2.95,8.59 2.14,7.78 D201.A
N$15  (via drill 0.5)
  Top 0.305: D303.A 36.14,22.81 36.62,23.28 | 36.62,23.28 v37.15,23.81 | 36.62,23.28 37.26,23.59 v37.15,23.81 | 36.62,23.28 36.92,23.92 v37.15,23.81
  Bottom 0.254: R303.2 10.88,46.79
  Bottom 0.305: 10.88,46.79 R302.2 12.93,47.85 13.89,48.82 34.13,48.82 37.15,45.8 37.15,24.56 | 37.15,24.56 v37.15,23.81 | R303.2 R305.1 | 37.15,24.56 36.91,23.89 v37.15,23.81 | 37.15,24.56 37.38,23.89 v37.15,23.81
N$16
  Top 0.61: CON401.P$3
  Top 1.016: M401.RF CON401.P$3
N$17
  Bottom 0.305: K201.2 7.06,7.79 7.54,7.3 7.54,6.11 7.91,5.74 R203.1
N$18
  Top 0.305: D303.C 36.14,14.87 35.64,14.37 33.73,14.37 32.99,13.62 J301.1
N$19
  Bottom 0.61: IC101.2 32.52,18.28 31.67,19.13 31.67,21.19 32.66,22.18 D101.A
N$23  (via drill 0.5)
  Top 0.305: v16.59,37.62 16.06,38.15 | 16.06,38.15 15.8,38.42 15.8,39.53 12.62,42.7 9.84,42.7 9.21,43.34 7.42,43.34 | 7.42,43.34 v6.67,43.34 | 16.06,38.15 16.37,37.52 v16.59,37.62 | 16.06,38.15 16.7,37.85 v16.59,37.62 | 7.42,43.34 6.75,43.57 v6.67,43.34 | 7.42,43.34 6.75,43.1 v6.67,43.34
  Bottom 0.305: IC201.44 15.12,36.16 16.06,37.09 | 16.06,37.09 v16.59,37.62 | 6.68,44.09 6.68,43.36 v6.67,43.34 | 6.68,44.09 R207.1 | v6.67,43.34 5.92,43.34 | 5.92,43.34 4.68,43.34 4.23,42.89 SV204.1 | 16.06,37.09 16.7,37.4 v16.59,37.62 | 16.06,37.09 16.37,37.73 v16.59,37.62 | 6.68,44.09 6.44,43.43 v6.67,43.34 | 6.68,44.09 6.9,43.41 v6.67,43.34 | 5.92,43.34 6.59,43.1 v6.67,43.34 | 5.92,43.34 6.59,43.57 v6.67,43.34
N$26
  Bottom 0.305: IC201.20 16.62,42.51 15.29,43.84 R206.1
NRF_CE  (via drill 0.5)
  Top 0.305: v21.67,35.64 21.67,34.89 | 21.67,34.89 21.67,32.54 22.3,31.91 30.4,31.91 33.64,28.67 M401.CE_2401 | 21.67,34.89 21.9,35.56 v21.67,35.64 | 21.67,34.89 21.44,35.56 v21.67,35.64
  Bottom 0.305: IC201.34 20.99,35.32 | 20.99,35.32 21.35,35.32 v21.67,35.64 | 20.99,35.32 21.7,35.39 v21.67,35.64 | 20.99,35.32 21.5,35.82 v21.67,35.64
NRF_CS  (via drill 0.5)
  Top 0.305: M401.CS_2401 21.64,27.1 19.05,29.69 19.01,29.69 | 19.01,29.69 v18.26,29.69 | 19.01,29.69 18.34,29.92 v18.26,29.69 | 19.01,29.69 18.34,29.45 v18.26,29.69
  Bottom 0.305: IC201.43 15.62,29.06 16.59,28.1 17.86,28.1 18.26,28.5 18.26,28.94 | 18.26,28.94 v18.26,29.69 | 18.26,28.94 18.49,29.61 v18.26,29.69 | 18.26,28.94 18.02,29.61 v18.26,29.69
PE1  (via drill 0.5)
  Top 0.305: v17.54,30.56 16.79,30.56 | 16.79,30.56 16.51,30.56 13.64,27.69 M401.PE1 | 16.79,30.56 17.46,30.33 v17.54,30.56 | 16.79,30.56 17.46,30.79 v17.54,30.56
  Bottom 0.305: IC201.40 17.12,31.18 | 17.12,31.18 17.12,30.98 v17.54,30.56 | 17.12,31.18 17.3,30.5 v17.54,30.56 | 17.12,31.18 17.69,30.76 v17.54,30.56
PE2  (via drill 0.5)
  Top 0.305: v16.91,29.69 16.43,29.69 16.2,29.45 | 16.2,29.45 15.64,28.89 M401.PE2 | 16.2,29.45 16.9,29.44 v16.91,29.69 | 16.2,29.45 16.76,29.88 v16.91,29.69
  Bottom 0.305: IC201.41 16.62,30.38 | 16.62,30.38 16.62,29.97 v16.91,29.69 | 16.62,30.38 16.66,29.67 v16.91,29.69 | 16.62,30.38 17.09,29.85 v16.91,29.69
PPM  (via drill 0.5)
  Top 0.305: v18.49,37.86 18.49,38.61 | 18.49,38.61 18.49,39.05 14.52,43.02 | 14.52,43.02 14.29,43.26 v13.81,43.26 | 18.49,38.61 18.26,37.94 v18.49,37.86 | 18.49,38.61 18.73,37.94 v18.49,37.86 | 14.52,43.02 13.96,43.46 v13.81,43.26 | 14.52,43.02 13.81,43.01 v13.81,43.26
  Bottom 0.305: IC201.29 19.24,37.82 | 19.24,37.82 18.54,37.82 v18.49,37.86 | v13.81,43.26 13.73,43.26 13.24,43.75 | 13.24,43.75 12.94,44.05 R302.1 | 19.24,37.82 18.59,38.09 v18.49,37.86 | 19.24,37.82 18.56,37.62 v18.49,37.86 | 13.24,43.75 13.6,43.14 v13.81,43.26 | 13.24,43.75 13.9,43.49 v13.81,43.26
RX  (via drill 0.5)
  Top 0.305: v27.07,35.08 27.07,35.72 27.17,35.83 | 27.17,35.83 29.84,38.5 31.59,38.5 32.78,39.69 32.78,41.43 35,43.66 35,50.8 33.66,52.15 32.86,52.15 32.07,52.94 SV202.2 | 27.17,35.83 26.85,35.2 v27.07,35.08 | 27.17,35.83 27.31,35.13 v27.07,35.08
  Bottom 0.305: IC201.31 24.3,36.82 26.04,35.08 26.32,35.08 | 26.32,35.08 v27.07,35.08 | 26.32,35.08 26.98,34.85 v27.07,35.08 | 26.32,35.08 26.98,35.32 v27.07,35.08
RXS
  Bottom 0.254: IC201.13 13.12,42.99 12.14,43.97 11.11,43.97 10.87,44.21 R303.1
S1  (via drill 0.5)
  Top 0.305: 12.89,39.24 11.19,37.54 11.19,37.23 10.16,36.2 10.16,35.56 4.37,29.77 4.37,14.68 10.21,8.84 S201.1 | 12.89,39.24 13.34,39.69 v13.49,39.69 | 12.89,39.24 13.57,39.45 v13.49,39.69 | 12.89,39.24 13.29,39.83 v13.49,39.69
  Bottom 0.305: IC201.14 13.62,40.43 | 13.62,40.43 13.62,39.82 v13.49,39.69 | 13.62,40.43 13.28,39.81 v13.49,39.69 | 13.62,40.43 13.74,39.73 v13.49,39.69
S2  (via drill 0.5)
  Top 0.305: 13.62,38.89 13.34,38.89 11.75,37.31 11.75,36.99 10.72,35.96 10.72,35.32 4.92,29.53 4.92,14.92 9.92,9.92 13.49,9.92 14.61,8.81 14.61,5.79 16.64,3.76 S201.2 | 13.62,38.89 v14.37,38.89 | 13.62,38.89 14.29,38.66 v14.37,38.89 | 13.62,38.89 14.29,39.13 v14.37,38.89
  Bottom 0.305: IC201.15 14.12,40.33 14.13,40.32 14.13,40.24 14.37,40.01 14.37,39.64 | 14.37,39.64 v14.37,38.89 | 14.37,39.64 14.13,38.98 v14.37,38.89 | 14.37,39.64 14.6,38.98 v14.37,38.89
S4  (via drill 0.5)
  Top 0.305: 12.99,37.75 12.3,37.07 12.3,36.75 11.27,35.72 11.27,35.08 5.48,29.29 5.48,15.16 10.16,10.48 13.73,10.48 15.16,9.05 15.16,6.74 | 12.99,37.75 13.34,38.1 v13.65,38.1 | 15.16,6.74 15.16,6.27 v15.4,6.03 | 12.99,37.75 13.69,37.85 v13.65,38.1 | 12.99,37.75 13.47,38.27 v13.65,38.1 | 15.16,6.74 15.15,6.04 v15.4,6.03 | 15.16,6.74 15.59,6.18 v15.4,6.03
  Bottom 0.305: IC201.16 14.62,40.46 14.92,40.16 14.92,39.45 15.16,39.21 15.16,38.66 14.61,38.1 14.4,38.1 | 14.4,38.1 v13.65,38.1 | v15.4,6.03 15.4,5.28 | 15.4,5.28 15.4,5 14.16,3.76 S201.4 | 14.4,38.1 13.73,38.33 v13.65,38.1 | 14.4,38.1 13.73,37.87 v13.65,38.1 | 15.4,5.28 15.63,5.95 v15.4,6.03 | 15.4,5.28 15.16,5.95 v15.4,6.03
S8  (via drill 0.5)
  Top 0.305: 13.7,37.31 13.34,37.31 12.86,36.83 12.86,36.51 11.83,35.48 11.83,34.85 6.03,29.05 6.03,15.4 10.4,11.03 13.97,11.03 16.16,8.84 S201.8 | 13.7,37.31 v14.45,37.31 | 13.7,37.31 14.37,37.07 v14.45,37.31 | 13.7,37.31 14.37,37.54 v14.45,37.31
  Bottom 0.305: v14.45,37.31 14.61,37.31 15.05,37.75 | 15.05,37.75 15.72,38.42 15.72,39.45 15.48,39.69 15.48,40.32 15.12,40.68 IC201.17 | 15.05,37.75 14.37,37.54 v14.45,37.31 | 15.05,37.75 14.65,37.17 v14.45,37.31
SCK  (via drill 0.5)
  Top 0.305: 28.63,30.24 26.11,30.24 25.64,29.77 M401.SCK 25.64,22.22 25,21.59 21.99,21.59 SV203.3 | 28.63,30.24 28.73,30.24 v29.21,29.77 | 28.63,30.24 29,29.64 v29.21,29.77 | 28.63,30.24 29.3,30 v29.21,29.77
  Bottom 0.305: IC201.26 25.29,39.32 28.89,35.72 28.89,30.45 | 28.89,30.45 28.89,30.08 v29.21,29.77 | 28.89,30.45 28.96,29.74 v29.21,29.77 | 28.89,30.45 29.39,29.94 v29.21,29.77
SPI_CS
  Bottom 0.305: IC201.38 18.12,31.01 18.97,30.16 18.97,22.07 19.61,21.43 19.61,19.21 SV203.4
TX  (via drill 0.5)
  Top 0.305: v26.27,35.88 26.43,35.88 26.88,36.32 | 26.88,36.32 29.61,39.05 31.35,39.05 32.23,39.93 32.23,41.67 34.45,43.89 34.45,50.56 33.42,51.59 30.24,51.59 29.53,52.31 SV202.3 | 26.88,36.32 26.2,36.11 v26.27,35.88 | 26.88,36.32 26.48,35.74 v26.27,35.88
  Bottom 0.305: IC201.30 24.83,37.32 25.74,36.41 | 25.74,36.41 v26.27,35.88 | 25.74,36.41 26.05,35.77 v26.27,35.88 | 25.74,36.41 26.38,36.1 v26.27,35.88
TXS  (via drill 0.5)
  Top 0.305: v16.83,44.05 17.58,44.05 | 17.58,44.05 22.19,44.05 | 22.19,44.05 v22.94,44.05 | 17.58,44.05 16.91,44.29 v16.83,44.05 | 17.58,44.05 16.91,43.82 v16.83,44.05 | 22.19,44.05 22.86,43.82 v22.94,44.05 | 22.19,44.05 22.86,44.29 v22.94,44.05
  Bottom 0.305: U301.1 23.27,44.78 23.23,44.74 | 23.23,44.74 22.94,44.45 v22.94,44.05 | v22.94,44.05 22.94,43.3 | 22.94,43.3 22.94,42.31 23.97,41.27 25.72,41.27 26.59,40.4 28.1,40.4 29.77,38.73 29.77,38.34 30.48,37.62 30.77,37.62 SJ301.1 | IC201.21 17.12,43.37 | 17.12,43.37 17.12,43.76 v16.83,44.05 | 17.12,43.37 17.07,44.07 v16.83,44.05 | 17.12,43.37 16.64,43.88 v16.83,44.05 | 23.23,44.74 22.76,44.22 v22.94,44.05 | 23.23,44.74 23.19,44.04 v22.94,44.05 | 22.94,43.3 23.17,43.97 v22.94,44.05 | 22.94,43.3 22.71,43.97 v22.94,44.05
USBDM  (via drill 0.5)
  Top 0.305: v15.95,35.64 15.42,35.11 | 15.42,35.11 15.24,34.92 13.49,34.92 7.67,29.11 | 7.67,29.11 7.38,28.81 v7.38,28.42 | 15.42,35.11 16.06,35.42 v15.95,35.64 | 15.42,35.11 15.73,35.75 v15.95,35.64 | 7.67,29.11 7.2,28.58 v7.38,28.42 | 7.67,29.11 7.63,28.4 v7.38,28.42
  Bottom 0.305: IC201.32 16.63,36.32 16.48,36.17 | 16.48,36.17 v15.95,35.64 | v7.38,28.42 7.46,28.34 7.78,28.34 8.05,28.07 | 8.05,28.07 8.26,27.86 8.26,26.99 7.78,26.51 4.84,26.51 4.37,26.04 4.37,17.38 3.25,16.27 2.14,16.27 1.67,15.8 1.67,15 3.1,13.57 9.53,13.57 10.24,12.86 10.24,7.94 9.74,7.44 R203.2 | 16.48,36.17 15.85,35.86 v15.95,35.64 | 16.48,36.17 16.18,35.53 v15.95,35.64 | 8.05,28.07 7.56,28.59 v7.38,28.42 | 8.05,28.07 7.35,28.17 v7.38,28.42
USBDP  (via drill 0.5)
  Top 0.305: v15.88,34.37 15.12,34.37 | 15.12,34.37 13.73,34.37 8.18,28.81 8.18,28.1 7.91,27.84 | 7.91,27.84 v7.38,27.3 | 15.12,34.37 15.79,34.14 v15.88,34.37 | 15.12,34.37 15.79,34.6 v15.88,34.37 | 7.91,27.84 7.27,27.53 v7.38,27.3 | 7.91,27.84 7.61,27.2 v7.38,27.3
  Bottom 0.305: IC201.33 17.32,35.82 16.41,34.9 | 16.41,34.9 v15.88,34.37 | v7.38,27.3 7.14,27.07 6.67,27.07 | 6.67,27.07 4.6,27.07 3.81,26.27 3.81,17.62 3.02,16.83 1.91,16.83 1.11,16.03 1.11,14.76 2.86,13.02 8.57,13.02 8.97,12.62 R204.2 | 16.41,34.9 15.77,34.59 v15.88,34.37 | 16.41,34.9 16.1,34.26 v15.88,34.37 | 6.67,27.07 7.38,27.06 v7.38,27.3 | 6.67,27.07 7.23,27.5 v7.38,27.3

### Text on the board
tPlace: MULTI-STM32 | Vin | ANT | TX | RX | 1-2: BOOT0 / 2-3: NC | GND | 1-2: 3V3 / 2-3: 5V | + | + | + | + | + | V1.1 (c) M. Bloos | (CC)-BY-NC-SA 4.0 | BIND
bPlace: MISO**MOSI / CS**SCK / GND**3V3